# Altium project STM32_Dev.PrjPcb
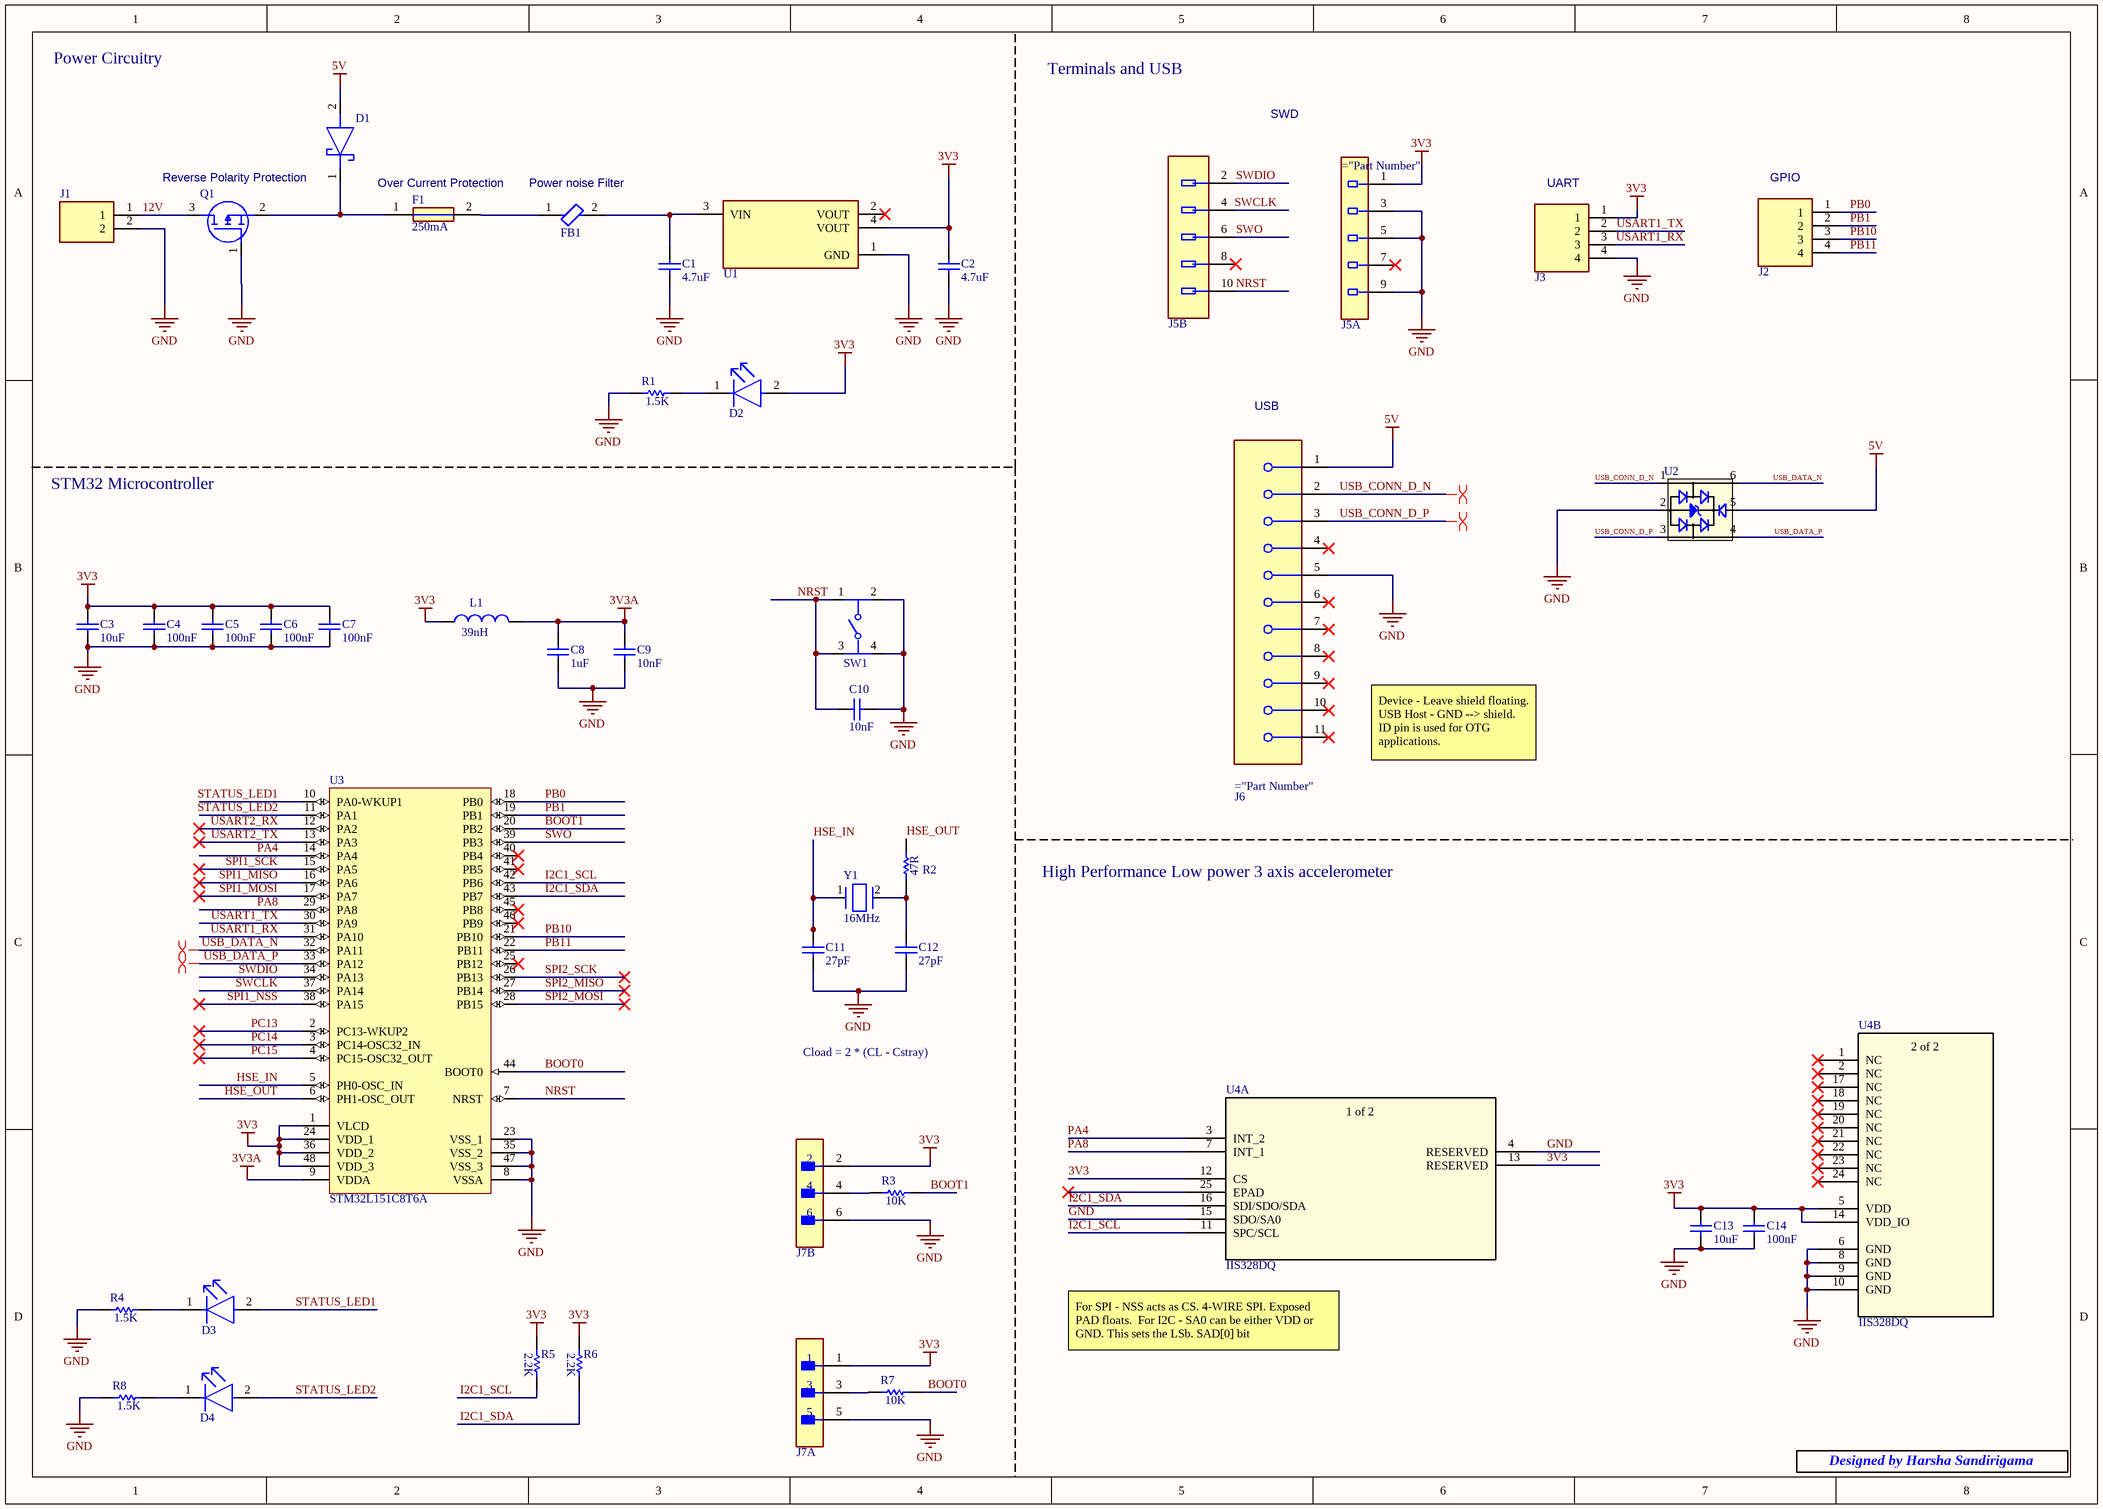
[diagram p0: STM32.SchDoc]
1 sheet, 42 parts. Net scope: global (net labels, ports and power ports of the same name join across sheets).
Board file: stm32dev.PcbDoc

## Sheet STM32.SchDoc: STM32 Dev Board by Harsha
size A3; Author: Harsha Sandirigama; DrawnBy: Harsha Sandirigama; Engineer: Harsha Sandirigama; SheetNumber: 1; SheetTotal: 1

### Parts
C1  4.7uF  [0603C - HD]
C2  4.7uF  [0603C - HD]
C3  10uF  [0603C - HD]
C4  100nF  [0603C - HD]
C5  100nF  [0603C - HD]
C6  100nF  [0603C - HD]
C7  100nF  [0603C - HD]
C8  1uF  [0603C - HD]
C9  10nF  [0603C - HD]
C10  10nF  [0603C - HD]
C11  27pF  [0603C - HD]
C12  27pF  [0603C - HD]
C13  10uF  [0603C - HD]
C14  100nF  [0603C - HD]
D1  PMEG4005CEJX  [SODFL2512X80N]  (value not drawn)
D2  LTST-C191KFKT  [Lite-On_0_MFG]  (value not drawn)
D3  LTST-C191KFKT  [Lite-On_0_MFG]  (value not drawn)
D4  LTST-C191KFKT  [Lite-On_0_MFG]  (value not drawn)
F1  250mA  [FUSC3115X66N]
FB1  MPZ1608Y101BTA00  [TDK_MPZ1608-0_8_IPC_A]  (value not drawn)
J1  12V  [PJ037AH]  (value not drawn)
J2  TS-104-T-AA  [HDRV4W46P0X254_1X4_1016X254X808P]  (value not drawn)
J3  TS-104-T-AA  [HDRV4W46P0X254_1X4_1016X254X808P]  (value not drawn)
J5  GRPB052VWQS-RC  [Sullins_GRPB052VWQS-RC_MFG]  (value not drawn)  (parts A,B of 2)
J6  USB3075-30-A  [Global_Connector_Technology_USB3075-30-A_0]  (value not drawn)
J7  67996-406HLF  [Amphenol_ICC_-_FCI_0_MFG]  (value not drawn)  (parts A,B of 2)
L1  39nH  [0603L - HD]
Q1  MOSFET P-CH  [SOT96P240X110-3N]  (value not drawn)
R1  RMCF0603FT1K50  [0603R - HD]  (value not drawn)
R2  47R  [0603R - HD]  (value not drawn)
R3  RNCF0603BTE10K0  [0603R - HD]  (value not drawn)
R4  RMCF0603FT1K50  [0603R - HD]  (value not drawn)
R5  RMCF0603FT2K20  [0603R - HD]  (value not drawn)
R6  RMCF0603FT2K20  [0603R - HD]  (value not drawn)
R7  RNCF0603BTE10K0  [0603R - HD]  (value not drawn)
R8  RMCF0603FT1K50  [0603R - HD]  (value not drawn)
SW1  PTS645SM43SMTR92LFS  [C&K_0_MFG - duplicate]  (value not drawn)
U1  ZLDO1117G33TA  [Diodes_SOT223_IPC_A]  (value not drawn)
U2  82400102  [SOT23_6L]  (value not drawn)
U3  STM32L151C8T6A  [QFP50P900X900X160-48N]
U4  IIS328DQ  [QFN-24_4X4MM_STM]  (parts A,B of 2)
Y1  16MHz  [ECS_Inc._ECS-160-20-3X-TR_0]

### Nets
3V3: C2.2 C3.2 C4.2 C5.2 C6.2 C7.2 C13.2 C14.2 D2.2(A) J3.1 J5.1 J7.1 J7.2 L1.1 R5.1 R6.1 U1.4(VOUT) U3.1(VLCD) U3.24(VDD_1) U3.36(VDD_2) U3.48(VDD_3) U4.5(VDD) U4.12(CS) U4.13(RESERVED) U4.14(VDD_IO)
3V3A: C8.2 C9.2 L1.2 U3.9(VDDA)
5V: D1.2(A) J6.1 U2.5(VDD)
GND: C1.1 C2.1 C3.1 C4.1 C5.1 C6.1 C7.1 C8.1 C9.1 C10.2 C11.1 C12.1 C13.1 C14.1 J1.2 J3.4 J5.3 J5.5 J5.9 J6.5 J7.5 J7.6 Q1.1(G) R1.1 R4.1 R8.1 SW1.2 SW1.4 U1.1(GND) U2.2(GND) U3.8(VSSA) U3.23(VSS_1) U3.35(VSS_2) U3.47(VSS_3) U4.4(RESERVED) U4.6(GND) U4.8(GND) U4.9(GND) U4.10(GND) U4.15(SDO/SA0)
12V: J1.1 Q1.3(D)
BOOT0: R7.2 U3.44(BOOT0)
BOOT1: R3.2 U3.20(PB2)
HSE_IN: C11.2 U3.5(PH0-OSC_IN) Y1.1
HSE_OUT: R2.2 U3.6(PH1-OSC_OUT)
I2C1_SCL: R5.2 U3.42(PB6) U4.11(SPC/SCL)
I2C1_SDA: R6.2 U3.43(PB7) U4.16(SDI/SDO/SDA)
NRST: C10.1 J5.10 SW1.1 SW1.3 U3.7(NRST)
PA4: U3.14(PA4) U4.3(INT_2)
PA8: U3.29(PA8) U4.7(INT_1)
PB0: J2.1 U3.18(PB0)
PB1: J2.2 U3.19(PB1)
PB10: J2.3 U3.21(PB10)
PB11: J2.4 U3.22(PB11)
PC13: U3.2(PC13-WKUP2)
PC14: U3.3(PC14-OSC32_IN)
PC15: U3.4(PC15-OSC32_OUT)
SPI1_MISO: U3.16(PA6)
SPI1_MOSI: U3.17(PA7)
SPI1_NSS: U3.38(PA15)
SPI1_SCK: U3.15(PA5)
SPI2_MISO: U3.27(PB14)
SPI2_MOSI: U3.28(PB15)
SPI2_SCK: U3.26(PB13)
STATUS_LED1: D3.2(A) U3.10(PA0-WKUP1)
STATUS_LED2: D4.2(A) U3.11(PA1)
SWCLK: J5.4 U3.37(PA14)
SWDIO: J5.2 U3.34(PA13)
SWO: J5.6 U3.39(PB3)
USART1_RX: J3.3 U3.31(PA10)
USART1_TX: J3.2 U3.30(PA9)
USART2_RX: U3.12(PA2)
USART2_TX: U3.13(PA3)
USB_CONN_D_N: J6.2 U2.1(I/O1)
USB_CONN_D_P: J6.3 U2.3(I/O2)
USB_DATA_N: U2.6(I/O1) U3.32(PA11)
USB_DATA_P: U2.4(I/O2) U3.33(PA12)
NetC1_2: C1.2 FB1.2 U1.3(VIN)
NetC12_2: C12.2 R2.1 Y1.2
NetD1_1: D1.1(K) F1.1 Q1.2(S)
NetD2_1: D2.1(C) R1.2
NetD3_1: D3.1(C) R4.2
NetD4_1: D4.1(C) R8.2
NetF1_2: F1.2 FB1.1
NetJ7_3: J7.3 R7.1
NetJ7_4: J7.4 R3.1

Not connected (* = marked no-connect by the designer): J5 7* 8*; J6 4* 6(MNT_1)* 7(MNT_2)* 8(MNT_3)* 9(MNT_4)* 10(MNT_5)* 11(MNT_6)*; U1 2(VOUT)*; U3 25(PB12)* 40(PB4)* 41(PB5)* 45(PB8)* 46(PB9)*; U4 1(NC)* 2(NC)* 17(NC)* 18(NC)* 19(NC)* 20(NC)* 21(NC)* 22(NC)* 23(NC)* 24(NC)* 25(EPAD)*

### Layout directives
differential pair: USB_CONN_D_N, USB_CONN_D_P, USB_DATA_N, USB_DATA_P

### Notes on the sheet
- Power Circuitry
- Terminals and USB
- (near D1) Reverse Polarity Protection
- Schottky Diode acts as an OR gate. When 5V active and 12V is inactive, the diode is forward biased.  In other cases, diode will be reverse biased. Schottky Diodes have faster switching times.
- SWD
- (near J2) GPIO
- Over Current Protection
- (near FB1) Power noise Filter
- (near J3) UART
- USB
- STM32 Microcontroller
- (near J6) ID pin can float because this is used as a device.
- Device - Leave shield floating.  USB Host - GND --> shield.  ID pin is used for OTG applications.
- High Performance Low power 3 axis accelerometer
- Cload = 2 * (CL - Cstray)
- For SPI - NSS acts as CS. 4-WIRE SPI. Exposed PAD floats.  For I2C - SA0 can be either VDD or GND. This sets the LSb. SAD[0] bit
- Designed by Harsha Sandirigama
- (in symbol IIS328DQ, part A) 1 of 2
- (in symbol IIS328DQ, part B) 2 of 2
- (in symbol RMCF0603FT1K50) 1.5K
- (in symbol RMCF0603FT2K20) 2.2K
- (in symbol RNCF0603BTE10K0) 10K

### Library data of the parts
C1 C2 = C1608X7S1A475K080AC: Cap Ceramic 4.7uF 10V X7S 10% SMD 0603 125°C Punched Paper T/R; Manufacturer: TDK; Frequency: 48MHz; Interface: I2C,SPI,USB,IrDA,UART,USART,EBI/EMI; Number of I/Os: 53; Oscillator Type: Internal; Memory Type: FLASH; Memory Size: 64KB; Peripherals: Brown-out Detect/Reset,POR,PWM,WDT,DMA,LCD; Core Architecture: ARM; Supplier 1: Digi-Key; Manufacturer Part Number: C1608X7S1A475K080AC; RoHS: Yes; Category: Ceramic Capacitors; Stock 1: 598789; Pricing 1: 1=0.30000, 10=0.20700, 50=0.12420, 100=0.10490, 500=0.07176, 1000=0.06348 (USD); Case/Package: LFBGA; Number of Pins: 64; Case Code (Metric): 1608; Case Code (Imperial): 0603; Dielectric Material: Ceramic; Min Operating Temperature: -40°C; Max Operating Temperature: 125°C; Package Quantity: 1000; Packaging: Tape and Reel; Capacitance: 4.7uF; Tolerance: 10%; Voltage Rating: 10V; Dielectric: X7S; Voltage Rating (DC): 10V; Series: Leopard Gecko; Length: 1.6mm; Depth: 0.8mm; Thickness: 800um; REACH SVHC: No SVHC; Lead Free: Lead Free; RoHS Compliant: Yes; ComponentLink1URL: https://datasheet.ciiva.com/14911/tdkmlcccaprange-14911942.pdf?src-supplier=Digi-Key; ComponentLink1Description: https://datasheet.ciiva.com/14911/tdkmlcccaprange-14911942.pdf?src-supplier=Digi-Key; ComponentLink2URL: https://datasheet.ciiva.com/14911/tdkmlcccaprange-14911943.pdf?src-supplier=Digi-Key; ComponentLink2Description: https://datasheet.ciiva.com/14911/tdkmlcccaprange-14911943.pdf?src-supplier=Digi-Key; ComponentLink3URL: https://datasheet.ciiva.com/14911/tdkmlcccaprange-14911944.pdf?src-supplier=Digi-Key; ComponentLink3Description: https://datasheet.ciiva.com/14911/tdkmlcccaprange-14911944.pdf?src-supplier=Digi-Key; Supplier Part Number 1: 445-14258-1-ND
C3 C13 = 06036D106MAT2A: AVX - 06036D106MAT2A - SMD Multilayer Ceramic Capacitor, 10 µF, 6.3 V, 0603 [1608 Metric], ± 20%, X5R, AVX 0603 MLCC; Manufacturer: Kyocera AVX; Voltage Rating: 6.3V; Supplier 1: Digi-Key; Manufacturer Part Number: 06036D106MAT2A; RoHS: Yes; Category: Ceramic Capacitors; Stock 1: 923568; Pricing 1: 1=0.22000, 10=0.14900, 50=0.08940, 100=0.07550, 500=0.05164, 1000=0.04568 (USD); Mount: Surface Mount,PCB; Case/Package: 0603; Number of Pins: 2; Case Code (Metric): 1608; Case Code (Imperial): 0603; Contact Plating: Tin,Matte; Dielectric Material: Ceramic; Min Operating Temperature: -55°C; Max Operating Temperature: 85°C; Capacitance: 10uF; Tolerance: 20%; Dielectric: X5R; Packaging: Tape and Reel; Package Quantity: 1; Voltage Rating (DC): 6.3V; Termination: SMD/SMT; Voltage: 6.3V; Series: -; Construction: Flat; Length: 1.6mm; Width: 0.032inch; Height: 0.9mm; Depth: 0.81mm; Thickness: 0.035inch; Radiation Hardening: No; Lead Free: Lead Free; REACH SVHC: No SVHC; RoHS Compliant: Yes; ComponentLink1URL: https://datasheet.ciiva.com/153/cx5r-153301.pdf?src-supplier=Digi-Key; ComponentLink1Description: https://datasheet.ciiva.com/153/cx5r-153301.pdf?src-supplier=Digi-Key; ComponentLink2URL: https://datasheet.ciiva.com/153/cx5r-153302.pdf?src-supplier=Digi-Key; ComponentLink2Description: https://datasheet.ciiva.com/153/cx5r-153302.pdf?src-supplier=Digi-Key; ComponentLink3URL: https://datasheet.ciiva.com/153/cx5r-153303.pdf?src-supplier=Digi-Key; ComponentLink3Description: https://datasheet.ciiva.com/153/cx5r-153303.pdf?src-supplier=Digi-Key; ComponentLink4URL: https://datasheet.ciiva.com/5422/cx5r-33896-5422935.pdf?src-supplier=Mouser; ComponentLink4Description: https://datasheet.ciiva.com/5422/cx5r-33896-5422935.pdf?src-supplier=Mouser; ComponentLink5URL: https://datasheet.ciiva.com/2987/cx5r-2987866.pdf?src-supplier=Avnet; ComponentLink5Description: https://datasheet.ciiva.com/2987/cx5r-2987866.pdf?src-supplier=Avnet; ComponentLink6URL: https://datasheet.ciiva.com/2987/cx5r-2987867.pdf?src-supplier=Avnet; ComponentLink6Description: https://datasheet.ciiva.com/2987/cx5r-2987867.pdf?src-supplier=Avnet; ComponentLink7URL: https://datasheet.ciiva.com/14591/70001028-14591754.pdf?src-supplier=Allied+Electronics; ComponentLink7Description: https://datasheet.ciiva.com/14591/70001028-14591754.pdf?src-supplier=Allied+Electronics; ComponentLink8URL: https://datasheet.ciiva.com/16201/cx5r-16201627.pdf?src-supplier=Future+Electronics; ComponentLink8Description: https://datasheet.ciiva.com/16201/cx5r-16201627.pdf?src-supplier=Future+Electronics; ComponentLink9URL: https://datasheet.ciiva.com/1458/1796776-1458117.pdf?src-supplier=Element14; ComponentLink9Description: https://datasheet.ciiva.com/1458/1796776-1458117.pdf?src-supplier=Element14; ComponentLink10URL: https://datasheet.ciiva.com/16538/cx5r-16538025.pdf?src-supplier=Avnet+Asia; ComponentLink10Description: https://datasheet.ciiva.com/16538/cx5r-16538025.pdf?src-supplier=Avnet+Asia; Supplier 2: Digi-Key; Stock 2: 923568; Pricing 2: 1=0.22000, 10=0.14900, 50=0.08940, 100=0.07550, 500=0.05164, 1000=0.04568 (USD); Supplier Part Number 1: 478-5318-1-ND; Supplier Part Number 2: 478-5318-6-ND
C4-C7 C14 = CL10B104KB8VPJC: 0.1 µF ±10% 50V Ceramic Capacitor X7R 0603 (1608 Metric); Manufacturer: Samsung; Supplier 1: Digi-Key; Manufacturer Part Number: CL10B104KB8VPJC; RoHS: Yes; Category: Ceramic Capacitors; Pricing 1: 1=0.15000, 10=0.11000, 50=0.06240, 100=0.05180, 500=0.03630, 1000=0.03005 (USD); Supplier 2: Mouser; Stock 2: 5857; Pricing 2: 1=0.16000, 10=0.07500, 50=0.07500, 100=0.05500, 1000=0.03400, 10000=0.02400 (USD); Supplier Part Number 1: 1276-CL10B104KB8VPJCCT-ND; Supplier Part Number 2: 187-CL10B104KB8VPJC
C8 = 0603BB105K160YT: CAP CER 1UF 16V X7R 0603; Manufacturer: Knowles Novacap; Tolerance: 10%; Supplier 1: Digi-Key; Manufacturer Part Number: 0603BB105K160YT; RoHS: No; Category: Ceramic Capacitors; Mount: Surface Mount; Case/Package: 0603; Min Operating Temperature: -55°C; Max Operating Temperature: 125°C; Packaging: Cut Tape; Capacitance: 1uF; Voltage Rating: 16V; ComponentLink1URL: http://www.knowlescapacitors.com/getmedia/b8129730-c7fe-4622-a4e1-683ad9deee84/Novacap_catalog_9345-14.aspx?src-supplier=Digi-Key; ComponentLink1Description: http://www.knowlescapacitors.com/getmedia/b8129730-c7fe-4622-a4e1-683ad9deee84/Novacap_catalog_9345-14.aspx?src-supplier=Digi-Key; Supplier Part Number 1: 1763-1175-1-ND
C9 C10 = CL10B103KB8WPJC: Capacitor Ceramic 0.01uF 10% 50V 2-Pin Surface Mount T/R; Manufacturer: Samsung; Supplier 1: Digi-Key; Manufacturer Part Number: CL10B103KB8WPJC; RoHS: Yes; Category: Ceramic Capacitors; Stock 1: 74489; Pricing 1: 1=0.11000, 10=0.08100, 50=0.04620, 100=0.03830, 500=0.02684, 1000=0.02222 (USD); RoHS Compliant: Yes; Supplier Part Number 1: 1276-CL10B103KB8WPJCCT-ND
C11 C12 = 06035A270JAT2A: CAP MLCC, 27PF, 50V, C0G/NP0, 5%, 0603; Manufacturer: Kyocera AVX; Dielectric: C0G; Temperature Coefficient: 0ppm/°C; Supplier 1: Digi-Key; Manufacturer Part Number: 06035A270JAT2A; RoHS: Yes; Category: Ceramic Capacitors; Stock 1: 36247; Pricing 1: 1=0.10000, 10=0.07000, 50=0.03800, 100=0.03100, 500=0.02214, 1000=0.01739 (USD); Mount: Surface Mount; Case/Package: 0603; Number of Pins: 2; Case Code (Imperial): 0603; Case Code (Metric): 1608; Contact Plating: Tin,Matte; Min Operating Temperature: -55°C; Max Operating Temperature: 125°C; Capacitance: 27pF; Tolerance: 5%; Packaging: Tape and Reel; Voltage Rating (DC): 50V; Voltage Rating: 50V; Package Quantity: 1; Termination: SMD/SMT; Voltage: 50V; Length: 1.6mm; Width: 0.81mm; Height: 0.63mm; Depth: 0.81mm; Thickness: 0.035inch; Radiation Hardening: No; REACH SVHC: No SVHC; Lead Free: Lead Free; ComponentLink1URL: https://datasheet.ciiva.com/22738/759117-22738072.pdf?src-supplier=Element14; ComponentLink1Description: https://datasheet.ciiva.com/22738/759117-22738072.pdf?src-supplier=Element14; ComponentLink2URL: https://datasheet.ciiva.com/7855/759117-7855066.pdf?src-supplier=Element14; ComponentLink2Description: https://datasheet.ciiva.com/7855/759117-7855066.pdf?src-supplier=Element14; ComponentLink3URL: https://datasheet.ciiva.com/150/ccog-150312.pdf?src-supplier=Digi-Key; ComponentLink3Description: https://datasheet.ciiva.com/150/ccog-150312.pdf?src-supplier=Digi-Key; ComponentLink4URL: https://datasheet.ciiva.com/150/ccog-150311.pdf?src-supplier=Digi-Key; ComponentLink4Description: https://datasheet.ciiva.com/150/ccog-150311.pdf?src-supplier=Digi-Key; ComponentLink5URL: https://datasheet.ciiva.com/150/ccog-150313.pdf?src-supplier=Digi-Key; ComponentLink5Description: https://datasheet.ciiva.com/150/ccog-150313.pdf?src-supplier=Digi-Key; Supplier Part Number 1: 478-1168-1-ND
D1 = PMEG4005CEJX: Rectifier Diode Schottky 40V 0.5A 1.8ns Automotive 2-Pin SOD-323F T/R; Manufacturer_Name: Nexperia; Datasheet Link: https://www.arrow.com/en/products/pmeg4005cejx/nexperia; Height: 0.8mm; Manufacturer_Part_Number: PMEG4005CEJX; Mouser Part Number: 771-PMEG4005CEJX; Mouser Price/Stock: https://www.mouser.co.uk/ProductDetail/Nexperia/PMEG4005CEJX?qs=1fQ7IOp4Wri3RvgD47E2KA%3D%3D; Arrow Part Number: PMEG4005CEJX; Arrow Price/Stock: https://www.arrow.com/en/products/pmeg4005cejx/nexperia?region=nac; Supplier 1: Digi-Key; Manufacturer: Nexperia; Manufacturer Part Number: PMEG4005CEJX; RoHS: Yes; Category: Schottky Diodes; Stock 1: 29989; Pricing 1: 1=0.42000, 10=0.30900, 100=0.17490, 500=0.11584, 1000=0.08880 (USD); RoHS Compliant: Yes; Supplier Part Number 1: 1727-8169-1-ND
D2-D4 = LTST-C191KFKT: Orange 0603 130° Water Clear 90 mcd 2 V SMT Rectangular Flat Top LED; Manufacturer: Vishay Lite-On; Lens Color: Colorless; Lens Style: Diffused,Colorless,Rectangular; Luminous Intensity: 90mcd; Forward Current: 30mA; Forward Voltage: 2V; Test Current: 20mA; Number of Elements: 1; Power Dissipation: 75mW; Reverse Voltage: 5V; Dominant Wavelength: 605nm; Wavelength: 611nm; Supplier 1: Digi-Key; Manufacturer Part Number: LTST-C191KFKT; RoHS: Yes; Category: LEDs; Stock 1: 298039; Pricing 1: 1=0.24000, 10=0.13200, 100=0.06110, 500=0.05640, 1000=0.04418, 2000=0.04324 (USD); Mount: Surface Mount; Case/Package: 0603; Number of Pins: 2; Color: Orange; Case Code (Metric): 1608; Case Code (Imperial): 0603; Min Operating Temperature: -55°C; Max Operating Temperature: 85°C; Package Quantity: 1; Viewing Angle: 130°; Packaging: Tape and Reel; Illumination Color: Orange; Lens Transparency: Clear; Number of LEDs: 1; Power Rating: 75mW; Length: 1.6mm; Width: 0.8mm; Height: 0.55mm; Depth: 0.8mm; Radiation Hardening: No; Lead Free: Lead Free; RoHS Compliant: Yes; ComponentLink1URL: https://datasheet.ciiva.com/2109/ltst-c191kfkt-2109968.pdf?src-supplier=Digi-Key; ComponentLink1Description: https://datasheet.ciiva.com/2109/ltst-c191kfkt-2109968.pdf?src-supplier=Digi-Key; ComponentLink2URL: https://datasheet.ciiva.com/12400/100-ltst-c191kfkt-39904-12400811.pdf?src-supplier=Mouser; ComponentLink2Description: https://datasheet.ciiva.com/12400/100-ltst-c191kfkt-39904-12400811.pdf?src-supplier=Mouser; ComponentLink3URL: https://datasheet.ciiva.com/11775/0900766b80dc02b0-11775613.pdf?src-supplier=RSComponents; ComponentLink3Description: https://datasheet.ciiva.com/11775/0900766b80dc02b0-11775613.pdf?src-supplier=RSComponents; ComponentLink4URL: https://datasheet.ciiva.com/15201/getdatasheetpartid-631075-15201391.pdf?src-supplier=Verical; ComponentLink4Description: https://datasheet.ciiva.com/15201/getdatasheetpartid-631075-15201391.pdf?src-supplier=Verical; ComponentLink5URL: https://datasheet.ciiva.com/2109/s-110-ltst-c191kfkt-2109969.pdf?src-supplier=Digi-Key; ComponentLink5Description: https://datasheet.ciiva.com/2109/s-110-ltst-c191kfkt-2109969.pdf?src-supplier=Digi-Key; Supplier Part Number 1: 160-1445-1-ND
F1 = C1Q250: Fuse Chip Very Fast Acting 0.25A 125V SMD Solder Pad 1206 Ceramic T/R CE/CSA/cULus; Manufacturer_Name: Stewart Connector; Manufacturer: Bel; Voltage Rating (DC): 63V; Fuse Type: Board Mount (Cartridge Style Excluded); DC Cold Resistance: 880mR; Power Dissipation: 100mW; Approvals: CSA,cULus,CE; Datasheet Link: https://datasheet.datasheetarchive.com/originals/distributors/Datasheets-6/DSA-118457.pdf; Height: 0.66mm; Manufacturer_Part_Number: C1Q250; Supplier 1: Digi-Key; Manufacturer Part Number: C1Q250; RoHS: Yes; Category: Fuses; Stock 1: 66554; Pricing 1: 1=0.32000, 5=0.31200, 10=0.29900, 50=0.26680, 100=0.24840, 250=0.22080, 500=0.18400, 1000=0.17480 (USD); Mount: Surface Mount; Case/Package: 1206; Number of Pins: 2; Case Code (Metric): 3216; Case Code (Imperial): 1206; Contact Plating: Tin; Housing Material: Ceramic; Min Operating Temperature: -55°C; Max Operating Temperature: 125°C; Current Rating: 250mA; Voltage Rating (AC): 125V; Series: C1Q; Packaging: Tape and Reel; Max Voltage Rating (DC): 63V; Voltage Rating: 125V; Length: 3.07mm; Width: 0.062inch; Depth: 1.52mm; RoHS Compliant: Yes; Lead Free: Lead Free; ComponentLink1URL: https://datasheet.ciiva.com/300/c1q-300584.pdf?src-supplier=Digi-Key; ComponentLink1Description: https://datasheet.ciiva.com/300/c1q-300584.pdf?src-supplier=Digi-Key; ComponentLink2URL: https://datasheet.ciiva.com/300/c1q-300585.pdf?src-supplier=Digi-Key; ComponentLink2Description: https://datasheet.ciiva.com/300/c1q-300585.pdf?src-supplier=Digi-Key; ComponentLink3URL: https://datasheet.ciiva.com/300/c1q-300586.pdf?src-supplier=Digi-Key; ComponentLink3Description: https://datasheet.ciiva.com/300/c1q-300586.pdf?src-supplier=Digi-Key; ComponentLink4URL: https://datasheet.ciiva.com/8264/c1q-8264010.pdf?src-supplier=Avnet; ComponentLink4Description: https://datasheet.ciiva.com/8264/c1q-8264010.pdf?src-supplier=Avnet; Supplier Part Number 1: 507-1073-1-ND
FB1 = MPZ1608Y101BTA00: Ind Chip Bead Multi-Layer 100Ohm 25% 100MHz Ferrite 2A 0603 Punched Paper T/R; Manufacturer: TDK; Impedance: 100R; DC Resistance (DCR): 40mR; Supplier 1: Digi-Key; Manufacturer Part Number: MPZ1608Y101BTA00; RoHS: Yes; Category: Ferrite Beads and Chips; Stock 1: 221776; Pricing 1: 1=0.10000, 10=0.07900, 25=0.07160, 50=0.06440, 100=0.04720, 250=0.03432, 500=0.03146, 1000=0.02717 (USD); Mount: Surface Mount; Case/Package: 0603; Case Code (Metric): 1608; Case Code (Imperial): 0603; Core Material: Ferrite; Tolerance: 25%; Current Rating: 2A; Packaging: Tape and Reel; Package Quantity: 4000; Max DC Current: 2A; Series: MPZ; Length: 0.063inch; Width: 0.031inch; Height: 0.037inch; RoHS Compliant: Yes; REACH SVHC: No SVHC; ComponentLink1URL: https://datasheet.ciiva.com/46634/beads-commercial-power-mpz-en-46634621.pdf?src-supplier=Digi-Key; ComponentLink1Description: https://datasheet.ciiva.com/46634/beads-commercial-power-mpz-en-46634621.pdf?src-supplier=Digi-Key; ComponentLink2URL: https://datasheet.ciiva.com/46634/beads-commercial-power-mpz-en-46634677.pdf?src-supplier=Digi-Key; ComponentLink2Description: https://datasheet.ciiva.com/46634/beads-commercial-power-mpz-en-46634677.pdf?src-supplier=Digi-Key; ComponentLink3URL: https://datasheet.ciiva.com/46634/beads-commercial-power-mpz-en-46634684.pdf?src-supplier=Digi-Key; ComponentLink3Description: https://datasheet.ciiva.com/46634/beads-commercial-power-mpz-en-46634684.pdf?src-supplier=Digi-Key; ComponentLink4URL: https://datasheet.ciiva.com/48682/beads-commercial-power-mpz-en-48682501.pdf?src-supplier=Avnet; ComponentLink4Description: https://datasheet.ciiva.com/48682/beads-commercial-power-mpz-en-48682501.pdf?src-supplier=Avnet; Supplier Part Number 1: 445-2984-1-ND
J1 = PJ-037AH: CONN PWR JACK 2X5.5MM SOLDER; Manufacturer_Name: CUI Inc.; Manufacturer: CUI; Voltage Rating: 24V; Gender: Male; Shielding: Unshielded; Current Rating: 5A; Insulation Resistance: 100MR; Number of Conductors: 2; Datasheet Link: https://www.arrow.com/en/products/pj-037ah/cui-devices; Height: 11.2mm; Manufacturer_Part_Number: PJ-037AH; Mouser Part Number: 490-PJ-037AH; Mouser Price/Stock: https://www.mouser.co.uk/ProductDetail/CUI-Devices/PJ-037AH?qs=WyjlAZoYn50M7m1AkzfPaQ%3D%3D; Arrow Part Number: PJ-037AH; Arrow Price/Stock: https://www.arrow.com/en/products/pj-037ah/cui-devices?region=nac; Supplier 1: Digi-Key; Manufacturer Part Number: PJ-037AH; RoHS: Yes; Category: Connectors; Stock 1: 64914; Pricing 1: 1=0.71000, 10=0.62200, 25=0.56880, 50=0.53520, 100=0.51290, 250=0.46832, 500=0.44600, 1000=0.36795, 2500=0.33450 (USD); Mount: Through Hole; Color: Black; Contact Material: Copper; Contact Plating: Nickel; Housing Color: Black; Housing Material: Thermoplastic; Min Operating Temperature: -25°C; Max Operating Temperature: 85°C; Package Quantity: 500; Termination: Solder; Series: -; Connector Type: Jack; Contact Gender: Male; Orientation: Horizontal; Lead Free: Lead Free; Flammability Rating: UL94 V-0; RoHS Compliant: Yes; ComponentLink1URL: http://www.mouser.com/ds/2/670/pj-037ah-516064.pdf?src-supplier=Mouser; ComponentLink1Description: http://www.mouser.com/ds/2/670/pj-037ah-516064.pdf?src-supplier=Mouser; ComponentLink2URL: https://www.cui.com/product/resource/digikeypdf/pj-037ah.pdf?src-supplier=Digi-Key; ComponentLink2Description: https://www.cui.com/product/resource/digikeypdf/pj-037ah.pdf?src-supplier=Digi-Key; Supplier Part Number 1: CP-037AH-ND
J2 J3 = TS-104-T-AA: Connector; Manufacturer_Name: SAMTEC; Datasheet Link: https://componentsearchengine.com/Datasheets/2/TS-104-T-AA.pdf; Height: 8.08mm; Manufacturer_Part_Number: TS-104-T-AA; Mouser Part Number: 200-TS104TAA; Mouser Price/Stock: https://www.mouser.co.uk/ProductDetail/Samtec/TS-104-T-AA?qs=0lQeLiL1qyZ41w70Oe2T%2Fg%3D%3D; Arrow Part Number: TS-104-T-AA; Arrow Price/Stock: https://www.arrow.com/en/products/ts-104-t-aa/samtec?region=nac
J5 = GRPB052VWQS-RC: Male, 10 C, SMT, .050" CC; 3.00mm Head/5.10mm Tail, Sf Mt; No GP, Nylon 9T, Brass, 105 C; Manufacturer: Sullins; Number of Positions: 10; Connector Type: Male Pin; Pitch: 0.05inch; Supplier 1: Digi-Key; Manufacturer Part Number: GRPB052VWQS-RC; RoHS: Yes; Category: Headers and Wire Housings; Stock 1: 18930; Pricing 1: 1=1.05000, 10=0.88400, 96=0.79396, 480=0.64963, 960=0.57744, 4992=0.52130 (USD); Mount: Surface Mount; Contact Plating: Gold; Package Quantity: 100; Number of Rows: 2; Packaging: Bulk; Termination: Solder; Contact Type: Male Pin; Row Spacing: 0.05inch; Contact Mating Length: 0.118inch; Lead Free: Lead Free; RoHS Compliant: Yes; ComponentLink1URL: https://datasheet.ciiva.com/726/grpb-20-2vwqs-rc2010958-c-726624.pdf?src-supplier=Digi-Key; ComponentLink1Description: https://datasheet.ciiva.com/726/grpb-20-2vwqs-rc2010958-c-726624.pdf?src-supplier=Digi-Key; Supplier Part Number 1: S9012E-05-ND
J6 = USB3075-30-A: Conn Micro USB Type B RCP 2Power/3Signal POS 0.65mm Solder RA SMD 5 Terminal 1 Port T/R; Manufacturer: Global Connector Technology; Gender: Receptacle; Number of Contacts: 5; USB Standard: USB 2.0; Supplier 1: Newark; Manufacturer Part Number: USB3075-30-A; RoHS: Yes; Category: USB Connectors; Stock 1: 25500; Pricing 1: 1=0.87500, 250=0.67300, 500=0.60600, 1000=0.55200, 1500=0.55200, 5000=0.50500 (USD); Mount: Surface Mount; Contact Material: Copper Alloy; Contact Plating: Gold; Weight: 0.001lb; Connector Type: USB; Termination: SMD/SMT; Orientation: Right Angle; Series: USB3075; Length: 0.525inch; Width: 0.525inch; Height: 0.525inch; REACH SVHC: No SVHC; Lead Free: Lead Free; RoHS Compliant: Yes; ComponentLink1URL: https://datasheet.ciiva.com/5803/usb3075-5803809.pdf?src-supplier=Farnell; ComponentLink1Description: https://datasheet.ciiva.com/5803/usb3075-5803809.pdf?src-supplier=Farnell; ComponentLink2URL: https://datasheet.ciiva.com/46420/usb3075-46420605.pdf?src-supplier=Element14; ComponentLink2Description: https://datasheet.ciiva.com/46420/usb3075-46420605.pdf?src-supplier=Element14; ComponentLink3URL: https://datasheet.ciiva.com/7633/1912469-7633847.pdf?src-supplier=Element14; ComponentLink3Description: https://datasheet.ciiva.com/7633/1912469-7633847.pdf?src-supplier=Element14; ComponentLink4URL: https://datasheet.ciiva.com/16502/usb3075-16502716.pdf?src-supplier=Future+Electronics; ComponentLink4Description: https://datasheet.ciiva.com/16502/usb3075-16502716.pdf?src-supplier=Future+Electronics; Supplier 2: Farnell; Stock 2: 25500; Pricing 2: 1500=0.33300, 7500=0.32600, 15000=0.32000, 30000=0.31300 (GBP); Supplier Part Number 1: 69AC6678; Supplier Part Number 2: 2443116
J7 = 67996-406HLF: CONN HEADER VERT 6POS 2.54MM; Manufacturer: Amphenol ICC / FCI; Number of Contacts: 6; Current Rating: 3A; Voltage Rating: 1.5kV; Insulation Resistance: 5GR; Gender: Male; Connector Type: Male Pin; Row Spacing: 0.1inch; Contact Post Length: 2.41mm; Supplier 1: Digi-Key; Manufacturer Part Number: 67996-406HLF; RoHS: Yes; Category: Headers and Wire Housings; Stock 1: 5419; Pricing 1: 1=0.29000, 10=0.27100, 100=0.18940, 500=0.16234, 1000=0.13528, 5000=0.11595, 10000=0.10822 (USD); Mount: Through Hole; Contact Plating: Tin; Contact Material: Bronze; Color: Black; Housing Color: Black; Housing Material: Thermoplastic; Min Operating Temperature: -65°C; Max Operating Temperature: 125°C; Number of Rows: 2; Termination: Solder; Contact Gender: Male; Package Quantity: 100; Packaging: Bulk; Number of Positions: 6; Max Voltage Rating (AC): 1.5kV; Orientation: Straight; Series: BergStik; Contact Type: Male Pin; Length: 7.62mm; Pitch: 2.54mm; Contact Mating Length: 0.23inch; Depth: 4.83mm; Radiation Hardening: No; REACH SVHC: No SVHC; RoHS Compliant: Yes; ComponentLink1URL: https://datasheet.ciiva.com/46393/1876884-46393070.pdf?src-supplier=Element14; ComponentLink1Description: https://datasheet.ciiva.com/46393/1876884-46393070.pdf?src-supplier=Element14; ComponentLink2URL: https://datasheet.ciiva.com/728/67996-728895.pdf?src-supplier=Digi-Key; ComponentLink2Description: https://datasheet.ciiva.com/728/67996-728895.pdf?src-supplier=Digi-Key; ComponentLink3URL: https://datasheet.ciiva.com/3205/67996-3205613.pdf?src-supplier=Avnet; ComponentLink3Description: https://datasheet.ciiva.com/3205/67996-3205613.pdf?src-supplier=Avnet; ComponentLink4URL: https://datasheet.ciiva.com/16726/67996-16726281.pdf?src-supplier=Avnet+Europe; ComponentLink4Description: https://datasheet.ciiva.com/16726/67996-16726281.pdf?src-supplier=Avnet+Europe; ComponentLink5URL: https://datasheet.ciiva.com/14639/70236872-14639895.pdf?src-supplier=Allied+Electronics; ComponentLink5Description: https://datasheet.ciiva.com/14639/70236872-14639895.pdf?src-supplier=Allied+Electronics; Supplier Part Number 1: 609-3218-ND
L1 = HK160839NJ-T: Ind High Frequency Chip Multi-Layer 39nH 5% 100MHz 12Q-Factor Ceramic 300mA 0603 T/R; Manufacturer: Taiyo Yuden; Core Material: Ferrite,Ceramic; Shielding: Unshielded; Self Resonant Frequency: 1.1GHz; DC Resistance (DCR): 600mR; Q Factor: 12; Supplier 1: Digi-Key; Manufacturer Part Number: HK160839NJ-T; RoHS: Yes; Category: Fixed Inductors; Stock 1: 39663; Pricing 1: 1=0.11000, 10=0.09600, 25=0.08560, 50=0.07280, 100=0.06430, 250=0.05892, 500=0.05356, 1000=0.04498 (USD); Mount: Surface Mount; Case/Package: 0603; Number of Pins: 2; Case Code (Metric): 1608; Case Code (Imperial): 0603; Body Material: Ceramic; Min Operating Temperature: -40°C; Max Operating Temperature: 85°C; Packaging: Tape and Reel; Inductance: 39nH; Current Rating: 300mA; Tolerance: 5%; Test Frequency: 100MHz; Inductance Tolerance: 5%; Package Quantity: 4000; Max DC Current: 300mA; Termination: SMD/SMT; Series: HK; Length: 0.063inch; Width: 0.031inch; Height: 0.8mm; Height - Seated (Max): 0.037inch; RoHS Compliant: Yes; Lead Free: Exempt; Halogen Free: Halogen Free; REACH SVHC: Unknown; ComponentLink1URL: https://datasheet.ciiva.com/8499/hk160839nj-t-ss-8499010.pdf?src-supplier=Avnet; ComponentLink1Description: https://datasheet.ciiva.com/8499/hk160839nj-t-ss-8499010.pdf?src-supplier=Avnet; ComponentLink2URL: https://datasheet.ciiva.com/30193/1171hk160839nj-t-30193223.pdf?src-supplier=Onlinecomponents.com; ComponentLink2Description: https://datasheet.ciiva.com/30193/1171hk160839nj-t-30193223.pdf?src-supplier=Onlinecomponents.com; ComponentLink3URL: https://datasheet.ciiva.com/7153/hk160839nj-t-ss-7153953.pdf?src-supplier=Newark; ComponentLink3Description: https://datasheet.ciiva.com/7153/hk160839nj-t-ss-7153953.pdf?src-supplier=Newark; Supplier Part Number 1: 587-1552-1-ND
Q1 = DMP3130LQ-7: Trans MOSFET P-CH 30V 3.5A Automotive 3-Pin SOT-23 T/R; Manufacturer_Name: Diodes Inc.; Manufacturer: Diodes; Rds On Max: 77mR; Input Capacitance: 864pF; Max Power Dissipation: 700mW; Drain to Source Resistance: 150mR; Datasheet Link: https://componentsearchengine.com/Datasheets/1/DMP3130LQ-7.pdf; Height: 1.1mm; Manufacturer_Part_Number: DMP3130LQ-7; Mouser Part Number: 621-DMP3130LQ-7; Mouser Price/Stock: https://www.mouser.co.uk/ProductDetail/Diodes-Incorporated/DMP3130LQ-7?qs=IXOKsUZacBE0XFAwZisciA%3D%3D; Arrow Part Number: DMP3130LQ-7; Arrow Price/Stock: https://www.arrow.com/en/products/dmp3130lq-7/diodes-incorporated; Supplier 1: Digi-Key; Manufacturer Part Number: DMP3130LQ-7; RoHS: Yes; Category: MOSFETs; Stock 1: 432; Pricing 1: 1=0.50000, 10=0.40700, 100=0.27740, 500=0.20804, 1000=0.15602 (USD); Mount: Surface Mount; Case/Package: TO-236-3; Min Operating Temperature: -55°C; Max Operating Temperature: 150°C; Packaging: Cut Tape; Drain to Source Voltage (Vdss): 30V; Continuous Drain Current (ID): 3.5A; REACH SVHC: No SVHC; Lead Free: Lead Free; RoHS Compliant: Yes; ComponentLink1URL: https://datasheet.ciiva.com/16438/ds31524-16438717.pdf?src-supplier=Future+Electronics; ComponentLink1Description: https://datasheet.ciiva.com/16438/ds31524-16438717.pdf?src-supplier=Future+Electronics; Supplier Part Number 1: DMP3130LQ-7DICT-ND
R1 R4 R8 = RMCF0603FT1K50: Res Thick Film 0603 1.5K Ohm 1% 0.1W(1/10W) ±100ppm/C Pad SMD Automotive T/R; Manufacturer: Stackpole Electronics; Resistance: 1.5kR; Max Power Dissipation: 100mW; Temperature Coefficient: 100ppm/°C; Supplier 1: Digi-Key; Supplier Part Number 1: RMCF0603FT1K50CT-ND; Manufacturer Part Number: RMCF0603FT1K50; RoHS: Yes; Category: Chip SMD Resistors; Stock 1: 1162707; Pricing 1: 1=0.10000, 10=0.01700, 100=0.00680, 1000=0.00305, 2500=0.00264 (USD); Mount: Surface Mount; Case/Package: 0603; Case Code (Metric): 1608; Case Code (Imperial): 0603; Contact Plating: Tin,Matte; Min Operating Temperature: -55°C; Max Operating Temperature: 155°C; Packaging: Tape and Reel; Tolerance: 1%; Resistor Type: Thick Film; Number of Terminations: 2; Features: Automotive AEC-Q200; Series: RMCF; Construction: Rectangular; Length: 1.55mm; Width: 0.031inch; Height: 0.022inch; Depth: 0.8mm; Radiation Hardening: No; Military Standard: Not; RoHS Compliant: Yes; ComponentLink1URL: http://components.arrow.com/part/dataview/44988068S6965504N1174?src-supplier=Arrow+Electronics; ComponentLink1Description: http://components.arrow.com/part/dataview/44988068S6965504N1174?src-supplier=Arrow+Electronics; ComponentLink2URL: https://www.seielect.com/catalog/SEI-Packaging.pdf?src-supplier=Digi-Key; ComponentLink2Description: https://www.seielect.com/catalog/SEI-Packaging.pdf?src-supplier=Digi-Key; ComponentLink3URL: https://www.seielect.com/catalog/SEI-RMCF_RMCP.pdf?src-supplier=Avnet; ComponentLink3Description: https://www.seielect.com/catalog/SEI-RMCF_RMCP.pdf?src-supplier=Avnet; ComponentLink4URL: https://www.verical.com/server-webapp/html/getDatasheet?partID=373264&src-supplier=Verical; ComponentLink4Description: https://www.verical.com/server-webapp/html/getDatasheet?partID=373264&src-supplier=Verical
R2 = RCS060347R0FKEA: RES SMD 47 OHM 1% 1/4W 0603; Manufacturer: Vishay Dale; Max Power Dissipation: 250mW; Temperature Coefficient: 100ppm/°C; Supplier 1: Digi-Key; Manufacturer Part Number: RCS060347R0FKEA; RoHS: Yes; Category: Chip SMD Resistors; Stock 1: 18040; Pricing 1: 1=0.15000, 10=0.13300, 100=0.05120, 1000=0.02252, 2500=0.01945 (USD); Case/Package: 0603; Min Operating Temperature: -55°C; Max Operating Temperature: 155°C; Package Quantity: 5000; Packaging: Tape and Reel; Resistance: 47R; Resistor Type: Thick Film; Number of Terminations: 2; Tolerance: 1%; Features: Automotive AEC-Q200; Length: 0.061inch; Width: 0.033inch; Height: 0.02inch; ComponentLink1URL: http://www.vishay.com/docs/20065/rcse3.pdf?src-supplier=Digi-Key; ComponentLink1Description: http://www.vishay.com/docs/20065/rcse3.pdf?src-supplier=Digi-Key; Supplier Part Number 1: 541-10470-1-ND
R3 R7 = RNCF0603BTE10K0: RES 10K OHM 0.1% 1/10W 0603; Supplier 1: Digi-Key; Supplier Part Number 1: RNCF0603BTE10K0CT-ND
R5 R6 = RMCF0603FT2K20: Res Thick Film 0603 2.2K Ohm 1% 0.1W(1/10W) ±100ppm/C Pad SMD Automotive T/R; Manufacturer: Stackpole Electronics; Power Rating: 100mW; Resistance: 2.2kR; Temperature Coefficient: 100ppm/°C; Supplier 1: Digi-Key; Manufacturer Part Number: RMCF0603FT2K20; RoHS: Yes; Category: Chip SMD Resistors; Stock 1: 1700907; Pricing 1: 1=0.10000, 10=0.01700, 100=0.00680, 1000=0.00305, 2500=0.00264 (USD); Mount: Surface Mount; Case/Package: 0603; Case Code (Metric): 1608; Case Code (Imperial): 0603; Contact Plating: Tin,Matte; Min Operating Temperature: -55°C; Max Operating Temperature: 155°C; Tolerance: 1%; Packaging: Tape and Reel; Resistor Type: Thick Film; Number of Terminations: 2; Max Power Dissipation: 100mW; Features: Automotive AEC-Q200; Series: RMCF; Length: 0.061inch; Width: 0.031inch; Height: 0.022inch; Radiation Hardening: No; Lead Free: Lead Free; RoHS Compliant: Yes; ComponentLink1URL: http://components.arrow.com/part/dataview/46931077S7088098N1174?src-supplier=Arrow+Electronics; ComponentLink1Description: http://components.arrow.com/part/dataview/46931077S7088098N1174?src-supplier=Arrow+Electronics; ComponentLink2URL: https://www.seielect.com/catalog/SEI-Packaging.pdf?src-supplier=Digi-Key; ComponentLink2Description: https://www.seielect.com/catalog/SEI-Packaging.pdf?src-supplier=Digi-Key; ComponentLink3URL: https://www.seielect.com/catalog/SEI-RMCF_RMCP.pdf?src-supplier=Avnet+Asia; ComponentLink3Description: https://www.seielect.com/catalog/SEI-RMCF_RMCP.pdf?src-supplier=Avnet+Asia; ComponentLink4URL: https://www.seielect.com/catalog/SEI-RMCF_RMCP.pdf?src-supplier=Avnet; ComponentLink4Description: https://www.seielect.com/catalog/SEI-RMCF_RMCP.pdf?src-supplier=Avnet; ComponentLink5URL: http://www.seielect.com/Catalog/SEI-rmc.pdf?src-supplier=Future+Electronics; ComponentLink5Description: http://www.seielect.com/Catalog/SEI-rmc.pdf?src-supplier=Future+Electronics; Supplier Part Number 1: RMCF0603FT2K20CT-ND
SW1 = PTS645SM43SMTR92LFS: SWITCH TACTILE SPST-NO 0.05A 12V; Manufacturer: ITT C&K; Mechanical Life: 100000Cycles; Actuator Material: Nylon,Polyamide,PA66; Throw Configuration: SPST; Operating Force: 160gf; Contact Resistance: 100mR; Max Current Rating: 50mA; Illumination Type: Non-Illuminated,Illuminated; Switch Function: Off-Mom; Actuator Type: Standard; Actuator Length: 0.85mm; Supplier 1: Digi-Key; Manufacturer Part Number: PTS645SM43SMTR92LFS; RoHS: Yes; Category: Tactile Switches; Stock 1: 1121749; Pricing 1: 1=0.25000, 10=0.24200, 25=0.22960, 100=0.20780, 250=0.18944, 500=0.17610 (USD); Mount: Surface Mount; Case/Package: SMD/SMT; Contact Plating: Silver; Contact Material: Silver; Color: Black; Min Operating Temperature: -20°C; Max Operating Temperature: 60°C; Max Voltage Rating (DC): 12V; Packaging: Tape and Reel; Termination: Gull Wing; Package Quantity: 1; Current Rating: 50mA; Voltage Rating (DC): 12V; Orientation: Straight; Series: PTS645; Length: 6mm; Depth: 9mm; Size: 6mm; Lead Free: Lead Free; RoHS Compliant: Yes; REACH SVHC: No SVHC; ComponentLink1URL: https://datasheet.ciiva.com/29931/getdatasheetpartid-764615-29931183.pdf?src-supplier=Verical; ComponentLink1Description: https://datasheet.ciiva.com/29931/getdatasheetpartid-764615-29931183.pdf?src-supplier=Verical; ComponentLink2URL: https://datasheet.ciiva.com/29903/getdatasheetpartid-786341-29903846.pdf?src-supplier=Verical; ComponentLink2Description: https://datasheet.ciiva.com/29903/getdatasheetpartid-786341-29903846.pdf?src-supplier=Verical; ComponentLink3URL: https://datasheet.ciiva.com/14920/pts645-14920733.pdf?src-supplier=Digi-Key; ComponentLink3Description: https://datasheet.ciiva.com/14920/pts645-14920733.pdf?src-supplier=Digi-Key; ComponentLink4URL: https://datasheet.ciiva.com/14920/pts645-14920734.pdf?src-supplier=Digi-Key; ComponentLink4Description: https://datasheet.ciiva.com/14920/pts645-14920734.pdf?src-supplier=Digi-Key; ComponentLink5URL: https://datasheet.ciiva.com/14920/pts645-14920735.pdf?src-supplier=Digi-Key; ComponentLink5Description: https://datasheet.ciiva.com/14920/pts645-14920735.pdf?src-supplier=Digi-Key; Supplier Part Number 1: CKN9112CT-ND
U1 = ZLDO1117G33TA: LDO Regulator Pos 3.3V 1A 4-Pin(3+Tab) SOT-223 T/R / IC REG LDO 3.3V 1A SOT223; Manufacturer: Diodes Zetex; Number of Outputs: 1; Min Input Voltage: 2.7V; Max Input Voltage: 18V; Max Power Dissipation: 15W; Polarity: Positive; Quiescent Current: 10mA; Accuracy: 2%; Output Type: Fixed; Dropout Voltage: 1.11V; Min Current Limit: 1.1A; Supplier 1: Digi-Key; Manufacturer Part Number: ZLDO1117G33TA; RoHS: Yes; Category: Voltage Regulators - Linear; Stock 1: 246729; Pricing 1: 1=0.54000, 10=0.45900, 25=0.42840, 100=0.34280, 250=0.31832, 500=0.26934 (USD); Mount: Surface Mount; Case/Package: SOT-223; Number of Pins: 3; Weight: 0.000282oz; Min Operating Temperature: -40°C; Max Operating Temperature: 125°C; Output Voltage: 3.3V; Max Output Current: 1A; Output Current: 1A; Packaging: Tape and Reel; Nominal Output Voltage: 3.3V; Package Quantity: 1000; Tolerance: 2%; Number of Regulators: 1; Reference Voltage: 3.3V; Min Output Voltage: 3.3V; Power Dissipation: 15W; Output Voltage Accuracy: 2%; Series: ZLDO1117; Length: 6.7mm; Width: 3.7mm; Height: 1.7mm; Radiation Hardening: No; REACH SVHC: No SVHC; Lead Free: Lead Free; RoHS Compliant: Yes; ComponentLink1URL: https://datasheet.ciiva.com/8078/608833-8078233.pdf?src-supplier=Element14; ComponentLink1Description: https://datasheet.ciiva.com/8078/608833-8078233.pdf?src-supplier=Element14; Supplier Part Number 1: ZLDO1117G33DICT-ND
U2 = CMP-1486-00007-1: TVS Diode Array WE-TVS 2-Ch+VDD 5V SOT23; Manufacturer: Wuerth Elektronik; Direction: Unidirectional; Capacitance: 2pF; Polarity: Bidirectional; Number of Bidirectional Channels: 2; Min Breakdown Voltage: 6V; Clamping Voltage: 7.7V; Power Line Protection: Yes; Max Reverse Leakage Current: 5A; Test Current: 1mA; Element Configuration: Dual; Max Surge Current: 6A; PartNumber: 82400102; ComponentLink2Description: Datasheet; PackageReference: SOT23_6L; ComponentLink1Description: Manufacturer URL; Reverse Stand Off Voltage: 5V; ComponentLink1URL: http://www.we-online.com; ComponentLink2URL: http://katalog.we-online.de/kataloge/eisos/media/pdf/82400102.pdf; Supplier 1: Digi-Key; Manufacturer Part Number: 82400102; RoHS: Yes; Category: Diodes; Stock 1: 490; Pricing 1: 1=0.84000, 10=0.80000, 50=0.74600, 100=0.69300, 500=0.61300 (USD); Mount: Surface Mount; Case/Package: SOT-23; Number of Pins: 6; Min Operating Temperature: -40°C; Max Operating Temperature: 125°C; Package Quantity: 1; Packaging: Tape and Reel; Reverse Standoff Voltage: 5V; Max Breakdown Voltage: 6V; ESD Protection: Yes; Breakdown Voltage: 6V; Termination: SMD/SMT; Number of Channels: 2; Working Voltage: 5V; Operating Supply Voltage: 6V; Peak Pulse Current: 6A; Series: WE-TVS; Length: 2.9mm; Width: 2.8mm; Height: 1.16mm; REACH SVHC: Unknown; RoHS Compliant: Yes; ComponentLink3URL: https://datasheet.ciiva.com/15063/82400102-15063552.pdf?src-supplier=Digi-Key; ComponentLink3Description: https://datasheet.ciiva.com/15063/82400102-15063552.pdf?src-supplier=Digi-Key; ComponentLink4URL: https://datasheet.ciiva.com/22694/82400102-22694066.pdf?src-supplier=Element14; ComponentLink4Description: https://datasheet.ciiva.com/22694/82400102-22694066.pdf?src-supplier=Element14; ComponentLink5URL: https://datasheet.ciiva.com/1276/82400102-1276088.pdf?src-supplier=Element14; ComponentLink5Description: https://datasheet.ciiva.com/1276/82400102-1276088.pdf?src-supplier=Element14; ComponentLink6URL: https://datasheet.ciiva.com/26308/82400102-eng-tds-26308059.pdf?src-supplier=Distrelec; ComponentLink6Description: https://datasheet.ciiva.com/26308/82400102-eng-tds-26308059.pdf?src-supplier=Distrelec; ComponentLink7URL: https://datasheet.ciiva.com/48698/001086791-da-01-ml-tvs-diode-array-we-tvs-82400102-de-en-48698283.pdf?src-supplier=Conrad; ComponentLink7Description: https://datasheet.ciiva.com/48698/001086791-da-01-ml-tvs-diode-array-we-tvs-82400102-de-en-48698283.pdf?src-supplier=Conrad; Supplier Part Number 1: 732-4473-1-ND
U3 = STM32L151C8T6A_1: MCU 32-bit ARM Cortex M3 RISC 64KB Flash 2.5V/3.3V 48-Pin LQFP Tray; Manufacturer: STMicroelectronics; Operating Frequency(F) (Processor speed) (MHz): 32; Core: ARM Cortex-M3; Data E2PROM nom (B): 4096; Supply Voltage(Vcc) min (V): 1.8; FLASH Size (Prog) (kB): 64; D/A Converter: 2; I/Os (High Current): 37; Frequency: 32MHz; Interface: I2C,SPI,USB,IrDA,UART,USART,LIN; Oscillator Type: Internal; RAM Size: 32KB; Min Supply Voltage: 1.8V; Max Supply Voltage: 3.6V; Peripherals: Brown-out Detect/Reset,POR,PWM,WDT,DMA; Data Bus Width: 32b; Number of Timers/Counters: 8; Watchdog Timer: Yes; Max Power Dissipation: 364mW; ComponentLink1Description: Manufacturer URL; ComponentLink2Description: Datasheet; DatasheetVersion: Rev. 4; Package Description: 48-Pin Low Profile Quad Flat Package, Body 7 x 7 mm, Pitch 0.5 mm; ComponentLink1URL: http://www.st.com/; Packing: Tray; Mounting Technology: Surface Mount; Internal RAM Size (kB): 32; ComponentLink2URL: http://www.st.com/st-web-ui/static/active/en/resource/technical/document/datasheet/DM00078689.pdf; Package Reference: LQFP48; PartNumber: STM32L151C8T6A; Supplier 1: Digi-Key; Manufacturer Part Number: STM32L151C8T6A; RoHS: Yes; Category: Microcontrollers; Stock 1: 5; Pricing 1: 1=5.76000, 10=5.16900, 25=4.88720, 80=4.23538, 250=4.01820, 500=3.62000 (USD); Mount: Surface Mount; Case/Package: LQFP; Number of Pins: 48; Min Operating Temperature: -40°C; Max Operating Temperature: 85°C; Packaging: Tray; Number of I/Os: 37; Memory Type: FLASH; Memory Size: 64KB; Max Frequency: 32MHz; Number of Programmable I/O: 37; Core Architecture: ARM; RoHS Compliant: Yes; REACH SVHC: No SVHC; Lead Free: Lead Free; ComponentLink3URL: http://www.farnell.com/datasheets/2308904.pdf?src-supplier=Farnell; ComponentLink3Description: http://www.farnell.com/datasheets/2308904.pdf?src-supplier=Farnell; ComponentLink4URL: http://www.mouser.com/ds/2/389/DM00078689-524617.pdf?src-supplier=Mouser; ComponentLink4Description: http://www.mouser.com/ds/2/389/DM00078689-524617.pdf?src-supplier=Mouser; ComponentLink5URL: http://www.st.com/content/ccc/resource/technical/document/datasheet/81/27/7d/29/b7/bd/49/f0/DM00078689.pdf/files/DM00078689.pdf/jcr:content/translations/en.DM00078689.pdf?src-supplier=Digi-Key; ComponentLink5Description: http://www.st.com/content/ccc/resource/technical/document/datasheet/81/27/7d/29/b7/bd/49/f0/DM00078689.pdf/files/DM00078689.pdf/jcr:content/translations/en.DM00078689.pdf?src-supplier=Digi-Key; ComponentLink6URL: http://www.st.com/web/en/resource/technical/document/datasheet/DM00098321.pdf?src-supplier=Avnet; ComponentLink6Description: http://www.st.com/web/en/resource/technical/document/datasheet/DM00098321.pdf?src-supplier=Avnet; ComponentLink7URL: http://www.farnell.com/datasheets/1897875.pdf?src-supplier=Element14; ComponentLink7Description: http://www.farnell.com/datasheets/1897875.pdf?src-supplier=Element14; ComponentLink8URL: http://www.st.com/web/en/resource/technical/document/datasheet/DM00098321.pdf?src-supplier=Avnet+Asia; ComponentLink8Description: http://www.st.com/web/en/resource/technical/document/datasheet/DM00098321.pdf?src-supplier=Avnet+Asia; Supplier Part Number 1: 497-17514-ND
U4 = IIS328DQ: High Performance Low power 3 axis accelerometer for industrial applications; Mfr_Name: STMicroelectronics; Manufacturer Part Number: IIS328DQTR; Bandwidth: 500Hz; Output Type: SPI,I2C; Axis: X, Y, Z; Min Supply Voltage: 2.16V; Max Supply Voltage: 3.6V; Copyright: Copyright (C) 2021 Ultra Librarian. All rights reserved.; Manufacturer_Part_Number: IIS328DQ; RefDes: RefDes; Type: DEV; Supplier 1: Digi-Key; Manufacturer: STMicroelectronics; RoHS: Yes; Category: Accelerometers; Stock 1: 30; Pricing 1: 1=5.32000, 10=4.77800, 25=4.51680, 100=3.91440, 500=3.34564 (USD); Mount: Surface Mount; Case/Package: QFN; Number of Pins: 24; Min Operating Temperature: -40°C; Max Operating Temperature: 105°C; Packaging: Cut Tape; REACH SVHC: No SVHC; Lead Free: Lead Free; ComponentLink1URL: http://www.farnell.com/datasheets/2028146.pdf?src-supplier=Farnell; ComponentLink1Description: http://www.farnell.com/datasheets/2028146.pdf?src-supplier=Farnell; ComponentLink2URL: http://www.st.com/st-web-ui/static/active/en/resource/technical/document/datasheet/DM00150114.pdf?src-supplier=Avnet; ComponentLink2Description: http://www.st.com/st-web-ui/static/active/en/resource/technical/document/datasheet/DM00150114.pdf?src-supplier=Avnet; ComponentLink3URL: http://www.st.com/content/ccc/resource/technical/document/datasheet/24/b9/50/c5/61/ae/4d/58/DM00150114.pdf/files/DM00150114.pdf/jcr:content/translations/en.DM00150114.pdf?src-supplier=Digi-Key; ComponentLink3Description: http://www.st.com/content/ccc/resource/technical/document/datasheet/24/b9/50/c5/61/ae/4d/58/DM00150114.pdf/files/DM00150114.pdf/jcr:content/translations/en.DM00150114.pdf?src-supplier=Digi-Key; ComponentLink4URL: http://www.farnell.com/datasheets/2028146.pdf?src-supplier=Newark; ComponentLink4Description: http://www.farnell.com/datasheets/2028146.pdf?src-supplier=Newark; ComponentLink5URL: http://www.farnell.com/datasheets/2028146.pdf?src-supplier=Element14; ComponentLink5Description: http://www.farnell.com/datasheets/2028146.pdf?src-supplier=Element14; Supplier Part Number 1: 497-15701-1-ND
Y1 = Crys_ECS_Inc._ECS-160-20-3X-TR_eec: Crystals 16MHz 20pF 50ppm -10C +70C; Manufacturer: ECS Inc.; Frequency Tolerance: 30ppm; ESR (Equivalent Series Resistance): 50R; Part Number: ECS-160-20-3X-TR; helpURL: https://upverter.com/upn/revision/104864cf044a7037/; ComponentLink2Description: Datasheet; Temperature: -10°C to +70°C; Package: XTAL_SMD_7MM0_4MM1; Supplier 2: Mouser; Price: 0.261262821276; Supplier 1: Digi-Key; ComponentLink1URL: https://upverter.com/upn/revision/104864cf044a7037/; Supplier Part Number 2: 520-160-20-3XT; Supplier Part Number 1: XC1776CT-ND; ComponentLink1Description: Upverter; ComponentLink2URL: https://upverter.com/datasheet/2e9e06c1bbd9708d42261281cd9889adb95c2d1a.pdf; RoHS: TRUE; Mouser Part Number: 520-160-20-3XT; Digikey Description: CRYSTAL 16.0000MHZ 20PF SMD; Digikey Part Number: XC1776CT-ND; Lead Free: yes; Temperature Range Low: -10°C; Temperature Range High: +70°C; Manufacturer Part Number: ECS-160-20-3X-TR; Category: Crystals; Stock 1: 87073; Pricing 1: 1=0.34000, 10=0.28800, 50=0.25880, 100=0.23000, 500=0.21850, 1000=0.18400 (USD); Mount: Surface Mount; Min Operating Temperature: -10°C; Max Operating Temperature: 70°C; Package Quantity: 1; Frequency: 16MHz; Load Capacitance: 20pF; Packaging: Tape and Reel; Tolerance: 30ppm; Frequency Stability: 50ppm; Termination: SMD/SMT; Series: CSM-3X; Length: 0.276inch; Width: 0.161inch; Height: 0.091inch; ComponentLink3URL: https://datasheet.ciiva.com/852/csm-3x-852328.pdf?src-supplier=Digi-Key; ComponentLink3Description: https://datasheet.ciiva.com/852/csm-3x-852328.pdf?src-supplier=Digi-Key; ComponentLink4URL: https://datasheet.ciiva.com/852/csm-3x-852329.pdf?src-supplier=Digi-Key; ComponentLink4Description: https://datasheet.ciiva.com/852/csm-3x-852329.pdf?src-supplier=Digi-Key; ComponentLink5URL: https://datasheet.ciiva.com/852/csm-3x-852330.pdf?src-supplier=Digi-Key; ComponentLink5Description: https://datasheet.ciiva.com/852/csm-3x-852330.pdf?src-supplier=Digi-Key